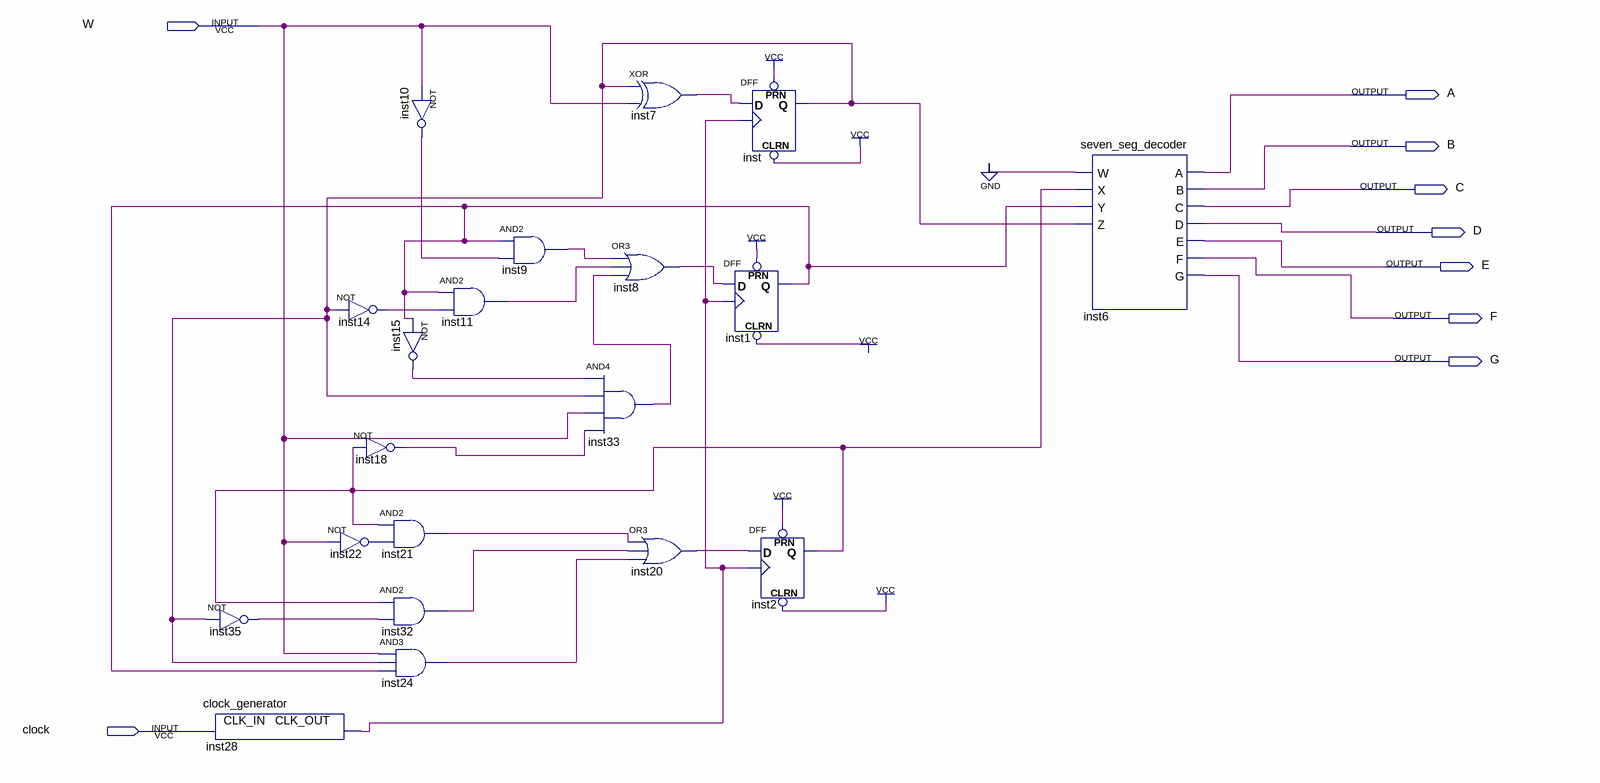
[diagram p0: schematic sheet]
// Quartus schematic Mod6Counter.bdf as structural Verilog: 20 symbols, 9 pins
module Mod6Counter (
  input  W,
  input  clock,
  output A,
  output B,
  output C,
  output D,
  output E,
  output F,
  output G
);

  wire inst1_q, inst2_q, inst7_out, inst8_out, inst9_out, inst10_out, inst11_out, inst14_out, inst15_out,
       inst18_out, inst20_out, inst21_out, inst22_out, inst24_out, inst28_clk_out, inst32_out, inst33_out,
       inst35_out, inst_q;

  clock_generator inst28 (.CLK_IN(clock), .CLK_OUT(inst28_clk_out));
  not inst35 (inst35_out, inst_q);
  not inst14 (inst14_out, inst_q);
  not inst22 (inst22_out, W);
  not inst10 (inst10_out, W);
  not inst15 (inst15_out, inst1_q);
  not inst18 (inst18_out, inst2_q);
  and inst21 (inst21_out, inst2_q, inst22_out);
  and inst32 (inst32_out, inst2_q, inst35_out);
  and inst24 (inst24_out, W, inst_q, inst1_q);
  and inst11 (inst11_out, inst1_q, inst14_out);
  and inst9 (inst9_out, inst1_q, inst10_out);
  or inst8 (inst8_out, inst9_out, inst11_out, inst33_out);
  and inst33 (inst33_out, inst15_out, inst_q, W, inst18_out);
  xor inst7 (inst7_out, inst_q, W);
  or inst20 (inst20_out, inst21_out, inst32_out, inst24_out);
  DFF inst (.CLRN(1'b1), .CLK(inst28_clk_out), .D(inst7_out), .PRN(1'b1), .Q(inst_q));
  DFF inst1 (.CLRN(1'b1), .CLK(inst28_clk_out), .D(inst8_out), .PRN(1'b1), .Q(inst1_q));
  DFF inst2 (.CLRN(1'b1), .CLK(inst28_clk_out), .D(inst20_out), .PRN(1'b1), .Q(inst2_q));
  seven_seg_decoder inst6 (
    .W(1'b0), .X(inst2_q), .Y(inst1_q), .Z(inst_q), .A(A), .B(B), .C(C), .D(D), .E(E), .F(F), .G(G));
endmodule
